# EAGLE design SparkFun Valve Control Shield (EAGLE 9.5.2)
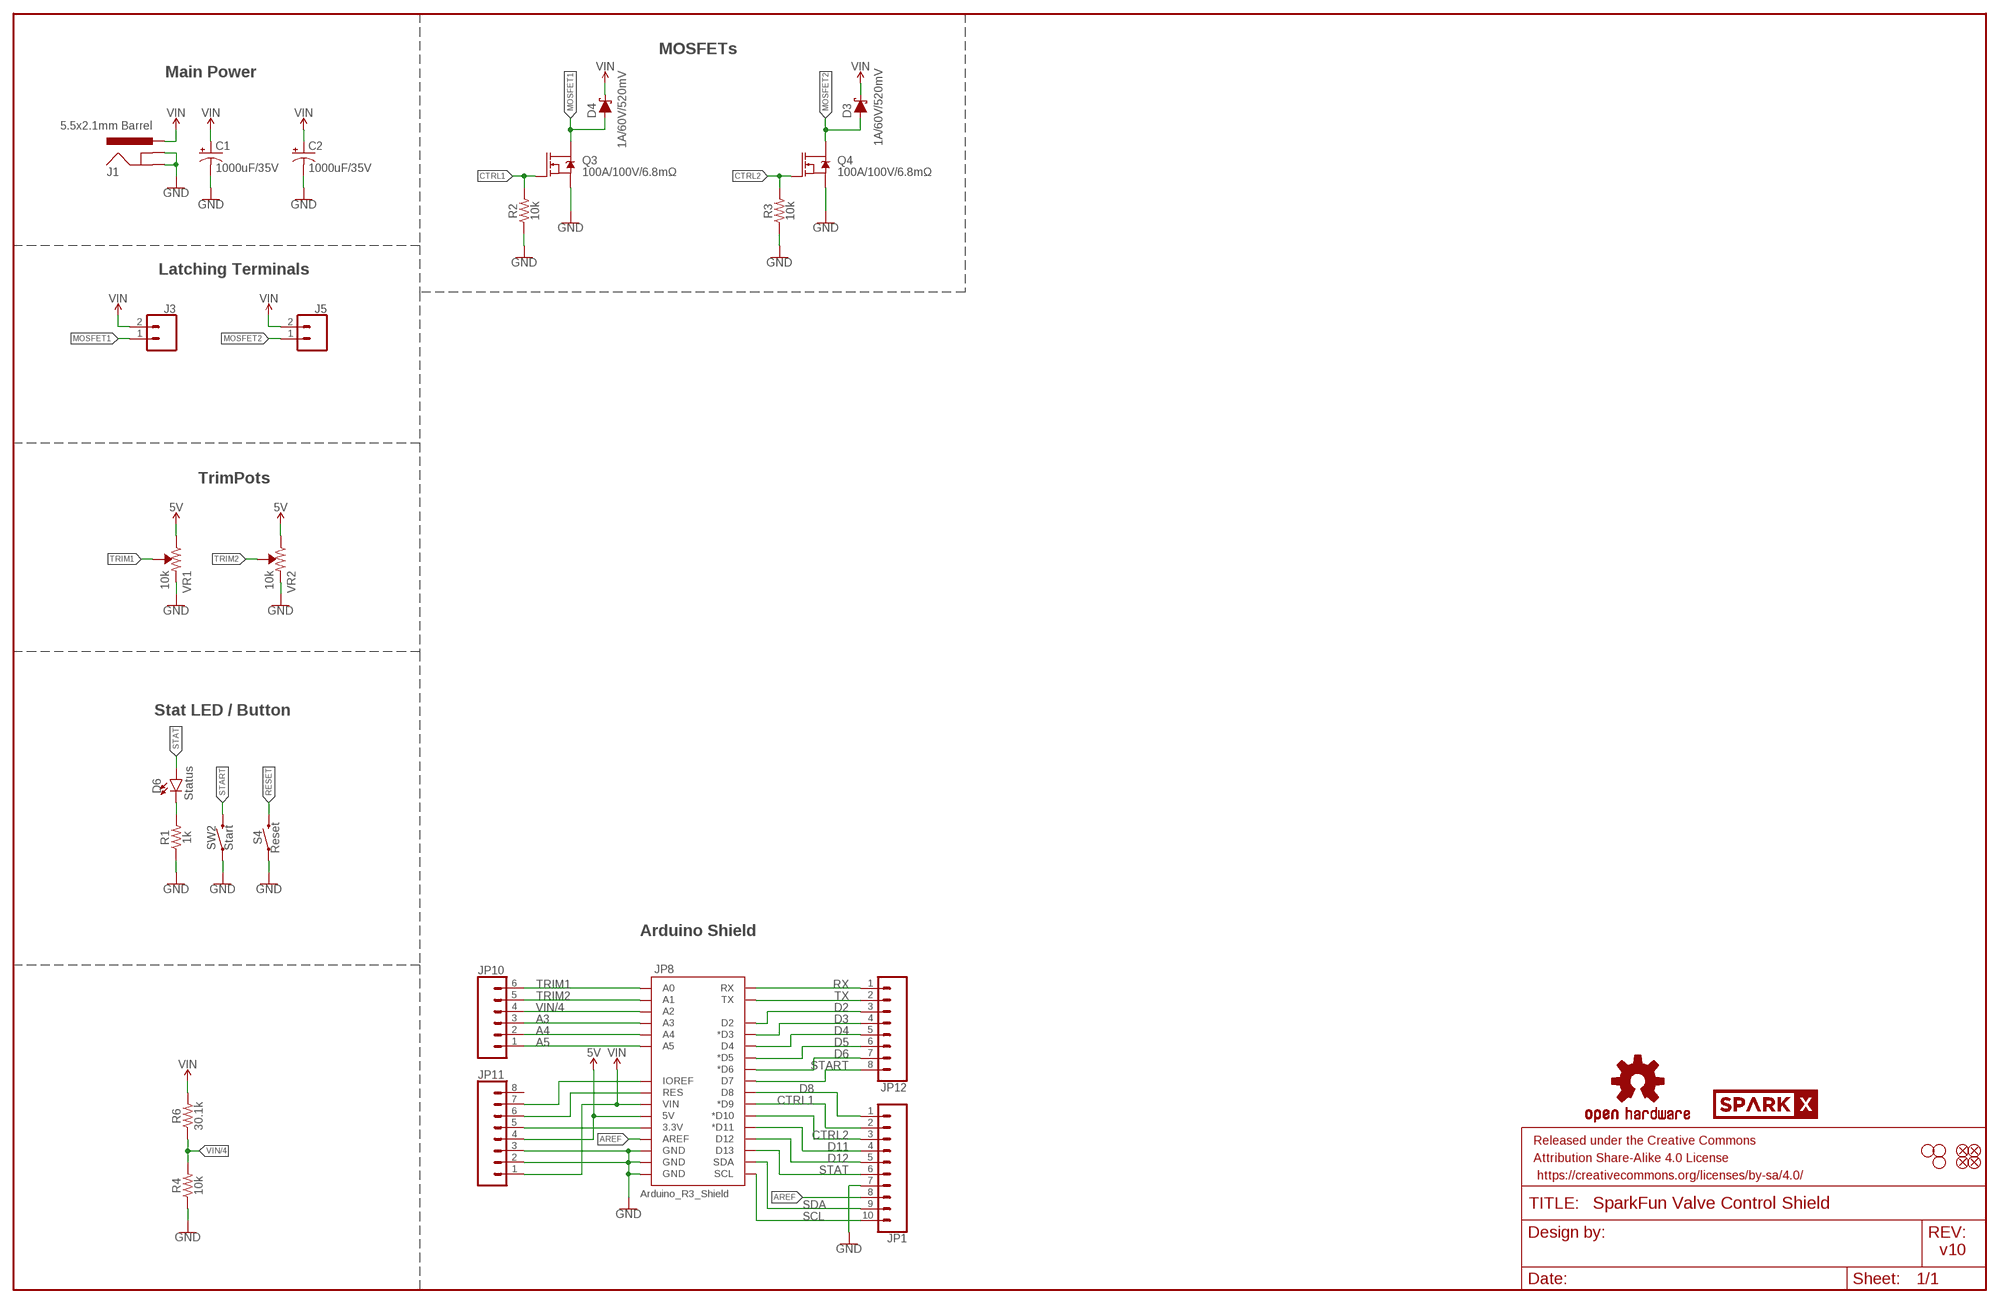
[diagram p0: schematic, sheet 1]

## Parts
C1  1000uF/35V  1000UF-RADIAL-5MM-35V-20%-KIT  [CPOL-RADIAL-5MM-10MM-KIT]
C2  1000uF/35V  1000UF-RADIAL-5MM-35V-20%-KIT  [CPOL-RADIAL-5MM-10MM-KIT]
D3  1A/60V/520mV  DIODE-SCHOTTKY-MSS1P6-M3/89A  [DIODE-MICRO-SMP]
D4  1A/60V/520mV  DIODE-SCHOTTKY-MSS1P6-M3/89A  [DIODE-MICRO-SMP]
D6  Status  LED1206  [LED-1206]
FD1  FIDUCIAL1X2  [FIDUCIAL-1X2]
FD2  FIDUCIAL1X2  [FIDUCIAL-1X2]
FD3  FIDUCIAL1X2  [FIDUCIAL-1X2]
FD4  FIDUCIAL1X2  [FIDUCIAL-1X2]
FRAME2  FRAME-LEDGER  [CREATIVE_COMMONS]
H1  STAND-OFF  [STAND-OFF]
H2  STAND-OFF  [STAND-OFF]
H4  STAND-OFF  [STAND-OFF]
J1  5.5x2.1mm Barrel  POWER_JACKSMD  [POWER_JACK_SMD]
J3  CONN_02LATCH_2  [LATCHTERMINAL-5MM-2]
J5  CONN_02LATCH_2  [LATCHTERMINAL-5MM-2]
JP1  CONN_10NO_SILK_PTH_FEMALE  [1X10_NO_SILK]
JP8  ARDUINO_R3_SHIELDNOLABELS  [UNO_R3_SHIELD_NOLABELS]
JP10  CONN_06NO_SILK_NO_POP  [1X06_NO_SILK]
JP11  CONN_08NO_SILK_FEMALE_PTH  [1X08_NO_SILK]
JP12  CONN_08NO_SILK_FEMALE_PTH  [1X08_NO_SILK]
LOGO1  OSHW-LOGOS  [OSHW-LOGO-S]
Q3  100A/100V/6.8mΩ  MOSFET-NCH-PSMN7R0  [TO-263/D2PAK]
Q4  100A/100V/6.8mΩ  MOSFET-NCH-PSMN7R0  [TO-263/D2PAK]
R1  1k  1KOHM-0603-1/10W-1%  [0603]
R2  10k  10KOHM-0603-1/10W-1%  [0603]
R3  10k  10KOHM-0603-1/10W-1%  [0603]
R4  10k  10KOHM-0603-1/10W-1%  [0603]
R6  30.1k  30.1KOHM-0603-1/10W-1%  [0603]
S4  Reset  MOMENTARY-SWITCH-SPST-SMD-5.2MM-TALL  [TACTILE_SWITCH_SMD_5.2MM]
SW2  Start  MOMENTARY-SWITCH-SPST-SMD-5.2MM-TALL  [TACTILE_SWITCH_SMD_5.2MM]
U$1  SPARKX-LOGO5  [SPARKX-LARGE]
VR1  10k  TRIMPOT-PTH-10MM-KNOB-1/2W-10%  [TRIMPOT-PTH-3386U]
VR2  10k  TRIMPOT-PTH-10MM-KNOB-1/2W-10%  [TRIMPOT-PTH-3386U]

## Nets
3.3: JP8.3.3V JP11.5
5V [power]: JP8.5V JP11.4 VR1.3(CW) VR2.3(CW)
A3: JP8.A3 JP10.3
A4: JP8.A4 JP10.2
A5: JP8.A5 JP10.1
AREF: JP1.8 JP8.AREF
CTRL1: JP1.2 JP8.D9(*D9) Q3.1(G) R2.2
CTRL2: JP1.3 JP8.D10(*D10) Q4.1(G) R3.2
D2: JP8.D2 JP12.3
D3: JP8.D3(*D3) JP12.4
D4: JP8.D4 JP12.5
D5: JP8.D5(*D5) JP12.6
D6: JP8.D6(*D6) JP12.7
D8: JP1.1 JP8.D8
D11: JP1.4 JP8.D11(*D11)
D12: JP1.5 JP8.D12
GND [power]: C1.- C2.- J1.GND(GNDBREAK) J1.P$4(GND) JP1.7 JP8.GND@0(GND) JP8.GND@1(GND) JP8.GND@2(GND) JP11.2 JP11.3 Q3.3(S) Q4.3(S) R1.1 R2.1 R3.1 R4.1 S4.1 SW2.1 VR1.1(CCW) VR2.1(CCW)
MOSFET1: D4.A J3.1 Q3.2(D)
MOSFET2: D3.A J5.1 Q4.2(D)
N$1: JP8.IOREF JP11.7
N$6: D6.C R1.2
RESET: JP8.RES JP11.6 S4.3
RX: JP8.RX JP12.1
SCL: JP1.10 JP8.SCL
SDA: JP1.9 JP8.SDA
START: JP8.D7 JP12.8 SW2.3
STAT: D6.A JP1.6 JP8.D13
TRIM1: JP8.A0 JP10.6 VR1.2(WIPER)
TRIM2: JP8.A1 JP10.5 VR2.2(WIPER)
TX: JP8.TX JP12.2
VIN: C1.+ C2.+ D3.C D4.C J1.VIN0(PWR) J3.2 J5.2 JP8.VIN JP11.1 R6.2
VIN/4: JP8.A2 JP10.4 R4.2 R6.1
Unconnected: JP11.8

## Notes on the sheet
- MOSFETs
- Main Power
- Latching Terminals
- TrimPots
- Stat LED / Button
- Arduino Shield
- Arduino_R3_Shield
- v10

## Library data of the parts
C1 C2 = SparkFun-Capacitors:1000UF: 1,000µF/1mF ceramic capacitors A capacitor is a passive two-terminal electrical component used to store electrical energy temporarily in an electric field. CAP-08070; PROD_ID: CAP-09538; VALUE: 1mf
D3 D4 = SparkFun-DiscreteSemi:DIODE-SCHOTTKY: Schottky diode A Schottky diode is a semiconductor diode which has a low forward voltage drop and a very fast switching action.; PROD_ID: DIO-13919
D6 = SparkFun-LED:LED: LED (Generic) Standard schematic elements and footprints for 5mm, 3mm, 1206, and 0603 sized LEDs. Generic LEDs with no color specified.
FD1-FD4 = SparkFun-Aesthetics:FIDUCIAL: Fiducial Alignment Points Point-of-reference for pick-and-place machines and other optical instruments.
FRAME2 = SparkFun-Aesthetics:FRAME-LEDGER: Schematic Frame - Ledger Standard 11x14 US Ledger frame
H1 H2 H4 = SparkFun-Hardware:STAND-OFF: Stand Off Drill holes for mechanically mounting via screws, standoffs, etc. Note: Use the keepout ring to avoid running the screw head into surrounding components. Variant Overviews STAND-OFF - Mechanical footprint for a #4 phillips button head screw. STAND-OFF-TIGHT - Mechanical footprint for a #4 phillips button head screw, Example SparkFun Products Screw - Phillips Head (1/4", 4-40, 10 pack) <https://www.sparkfun.com/products/10453> (PRT-10453) Screw - Phillips Head (1/2", 4-40, 10 pack) <https://www.sparkfun.com/products/10452> (PRT-10452) Screw - Phillips Head (3/4", 4-40, 10 pack) <https://www.sparkfun.com/products/10451> (PRT-10451) Screw - Phillips Head (1", 4-40, 10 pack) <https://www.sparkfun.com/products/10450> (PRT-10450)
J1 = SparkFun-Connectors:POWER_JACK: Power Jack Connector This is the standard 5.5mm barrel jack for power. The PTH is the most common, proven, reliable, footprint. The Slot footprint only works if the mill layer is transmitted to the PCB fab house so be warned. Here are the connectors we sell at SparkFun: DC Barrel Power Jack/Connector <https://www.sparkfun.com/products/119> (PRT-00119) DC Barrel Power Jack/Connector (SMD) <https://www.sparkfun.com/products/12748> (PRT-12748) DC Barrel Jack Adapter - Breadboard Compatible <https://www.sparkfun.com/products/10811> (PRT-10811) It is used on this SparkFun product (and many, many others): SparkFun RedBoard - Programmed with Arduino <https://www.sparkfun.com/products/12757> (DEV-12757) Also, if you need a mating power supply or connector, please check these out: Wall Adapter Power Supply - 9VDC 650mA <https://www.sparkfun.com/products/298> (TOL-00298) DC Barrel Jack Adapter - Male <https://www.sparkfun.com/products/10287> (PRT-10287); PROD_ID: CONN-08106; SF_ID: PRT-12748
J3 J5 = SparkFun-Connectors:CONN_02: Multi connection point. Often used as Generic Header-pin footprint for 0.1 inch spaced/style header connections On any of the 0.1 inch spaced packages, you can populate with these: Break Away Headers - Straight <https://www.sparkfun.com/products/116> (PRT-00116) Break Away Male Headers - Right Angle <https://www.sparkfun.com/products/553> (PRT-00553) Female Headers <https://www.sparkfun.com/products/115> (PRT-00115) Break Away Headers - Machine Pin <https://www.sparkfun.com/products/117> (PRT-00117) Break Away Female Headers - Swiss Machine Pin <https://www.sparkfun.com/products/743> (PRT-00743) For SCREWTERMINALS and SPRING TERMINALS visit here: Screw Terimnals on SparkFun.com <https://www.sparkfun.com/search/results?term=Screw+Terminals> (5mm/3.5mm/2.54mm spacing) This device is also useful as a general connection point to wire up your design to another part of your project. Our various solder wires solder well into these plated through hole pads. Hook-Up Wire - Assortment (Stranded, 22 AWG) <https://www.sparkfun.com/products/11375> (PRT-11375) Hook-Up Wire - Assortment (Solid Core, 22 AWG) <https://www.sparkfun.com/products/11367> (PRT-11367) View the entire wire category on our website here <https://www.sparkfun.com/categories/141> Special notes: Molex polarized connector foot print use with: PRT-08233 with associated crimp pins and housings. 2.54_SCREWTERM for use with PRT-10571. 3.5mm Screw Terminal footprints for PRT-08084 5mm Screw Terminal footprints for use with PRT-08432; PROD_ID: PRT-15898
JP1 = SparkFun-Connectors:CONN_10: Multi connection point. Often used as Generic Header-pin footprint for 0.1 inch spaced/style header connections On any of the 0.1 inch spaced packages, you can populate with these: Break Away Headers - Straight <https://www.sparkfun.com/products/116> (PRT-00116) Break Away Male Headers - Right Angle <https://www.sparkfun.com/products/553> (PRT-00553) Female Headers <https://www.sparkfun.com/products/115> (PRT-00115) Break Away Headers - Machine Pin <https://www.sparkfun.com/products/117> (PRT-00117) Break Away Female Headers - Swiss Machine Pin <https://www.sparkfun.com/products/743> (PRT-00743) Arduino Stackable Header - 10 Pin <https://www.sparkfun.com/products/11376> (PRT-11376) For SCREWTERMINALS and SPRING TERMINALS visit here: Screw Terimnals on SparkFun.com <https://www.sparkfun.com/search/results?term=Screw+Terminals> (5mm/3.5mm/2.54mm spacing) This device is also useful as a general connection point to wire up your design to another part of your project. Our various solder wires solder well into these plated through hole pads. Hook-Up Wire - Assortment (Stranded, 22 AWG) <https://www.sparkfun.com/products/11375> (PRT-11375) Hook-Up Wire - Assortment (Solid Core, 22 AWG) <https://www.sparkfun.com/products/11367> (PRT-11367) View the entire wire category on our website here <https://www.sparkfun.com/categories/141> Special notes: Molex polarized connector foot print use with SKU : PRT-08231 with associated crimp pins and housings. 1MM SMD Version SKU: PRT-10208 NOTES ON THE VARIANTS LOCK and LOCK_LONGPADS... This footprint was designed to help hold the alignment of a through-hole component (i.e. 6-pin header) while soldering it into place. You may notice that each hole has been shifted either up or down by 0.005 of an inch from it's more standard position (which is a perfectly straight line). This slight alteration caused the pins (the squares in the middle) to touch the edges of the holes. Because they are alternating, it causes a "brace" to hold the component in place. 0.005 has proven to be the perfect amount of "off-center" position when using our standard breakaway headers. Although looks a little odd when you look at the bare footprint, once you have a header in there, the alteration is very hard to notice. Also,if you push a header all the way into place, it is covered up entirely on the bottom side.
JP8 = TempLibrary:ARDUINO_R3_SHIELD: Shield form compatible with the Arduino Uno R3.
JP10 = SparkFun-Connectors:CONN_06: Multi connection point. Often used as Generic Header-pin footprint for 0.1 inch spaced/style header connections On any of the 0.1 inch spaced packages, you can populate with these: Break Away Headers - Straight <https://www.sparkfun.com/products/116> (PRT-00116) Break Away Male Headers - Right Angle <https://www.sparkfun.com/products/553> (PRT-00553) Female Headers <https://www.sparkfun.com/products/115> (PRT-00115) Break Away Headers - Machine Pin <https://www.sparkfun.com/products/117> (PRT-00117) Break Away Female Headers - Swiss Machine Pin <https://www.sparkfun.com/products/743> (PRT-00743) Arduino Stackable Header - 6 Pin <https://www.sparkfun.com/products/9280> (PRT-09280) For SCREWTERMINALS and SPRING TERMINALS visit here: Screw Terimnals on SparkFun.com <https://www.sparkfun.com/search/results?term=Screw+Terminals> (5mm/3.5mm/2.54mm spacing) This device is also useful as a general connection point to wire up your design to another part of your project. Our various solder wires solder well into these plated through hole pads. Hook-Up Wire - Assortment (Stranded, 22 AWG) <https://www.sparkfun.com/products/11375> (PRT-11375) Hook-Up Wire - Assortment (Solid Core, 22 AWG) <https://www.sparkfun.com/products/11367> (PRT-11367) View the entire wire category on our website here <https://www.sparkfun.com/categories/141>
JP11 JP12 = SparkFun-Connectors:CONN_08: Multi connection point. Often used as Generic Header-pin footprint for 0.1 inch spaced/style header connections On any of the 0.1 inch spaced packages, you can populate with these: Break Away Headers - Straight <https://www.sparkfun.com/products/116> (PRT-00116) Break Away Male Headers - Right Angle <https://www.sparkfun.com/products/553> (PRT-00553) Female Headers <https://www.sparkfun.com/products/115> (PRT-00115) Break Away Headers - Machine Pin <https://www.sparkfun.com/products/117> (PRT-00117) Break Away Female Headers - Swiss Machine Pin <https://www.sparkfun.com/products/743> (PRT-00743) Arduino Stackable Header - 8 Pin <https://www.sparkfun.com/products/9279> (PRT-09279) For SCREWTERMINALS and SPRING TERMINALS visit here: Screw Terimnals on SparkFun.com <https://www.sparkfun.com/search/results?term=Screw+Terminals> (5mm/3.5mm/2.54mm spacing) This device is also useful as a general connection point to wire up your design to another part of your project. Our various solder wires solder well into these plated through hole pads. Hook-Up Wire - Assortment (Stranded, 22 AWG) <https://www.sparkfun.com/products/11375> (PRT-11375) Hook-Up Wire - Assortment (Solid Core, 22 AWG) <https://www.sparkfun.com/products/11367> (PRT-11367) View the entire wire category on our website here <https://www.sparkfun.com/categories/141> Special notes: Molex polarized connector foot print use with SKU : PRT-08231 with associated crimp pins and housings. 1MM SMD Version SKU: PRT-10208 NOTES ON THE VARIANTS LOCK and LOCK_LONGPADS... This footprint was designed to help hold the alignment of a through-hole component (i.e. 6-pin header) while soldering it into place. You may notice that each hole has been shifted either up or down by 0.005 of an inch from it's more standard position (which is a perfectly straight line). This slight alteration caused the pins (the squares in the middle) to touch the edges of the holes. Because they are alternating, it causes a "brace" to hold the component in place. 0.005 has proven to be the perfect amount of "off-center" position when using our standard breakaway headers. Although looks a little odd when you look at the bare footprint, once you have a header in there, the alteration is very hard to notice. Also,if you push a header all the way into place, it is covered up entirely on the bottom side.; PROD_ID: CONN-08438
LOGO1 = SparkFun-Aesthetics:OSHW-LOGO: Open-Source Hardware (OSHW) Logo This logo indicates the piece of hardware it is found on incorporates a OSHW license and/or adheres to the definition of open source hardware found here: http://freedomdefined.org/OSHW
Q3 Q4 = SparkFun-DiscreteSemi:MOSFET-NCH: N-channel MOSFETs Voltage controlled devices that allow control of high current outputs. SparkFun Products: SparkFun OpenScale <https://www.sparkfun.com/products/13261> SparkFun Digital Sandbox <https://www.sparkfun.com/products/12651> SparkFun Monster Moto Shield <https://www.sparkfun.com/products/10182> SparkFun MOSFET Power Controller <https://www.sparkfun.com/products/11214>; PROD_ID: TRANS-12437
R1 = SparkFun-Resistors:1KOHM: 1kΩ resistor A resistor is a passive two-terminal electrical component that implements electrical resistance as a circuit element. Resistors act to reduce current flow, and, at the same time, act to lower voltage levels within circuits. - Wikipedia; PROD_ID: RES-07856
R2-R4 = SparkFun-Resistors:10KOHM: 10kΩ resistor A resistor is a passive two-terminal electrical component that implements electrical resistance as a circuit element. Resistors act to reduce current flow, and, at the same time, act to lower voltage levels within circuits. - Wikipedia; PROD_ID: RES-00824
R6 = SparkFun-Resistors:30.1KOHM: 30.1kΩ resistor A resistor is a passive two-terminal electrical component that implements electrical resistance as a circuit element. Resistors act to reduce current flow, and, at the same time, act to lower voltage levels within circuits. - Wikipedia; PROD_ID: RES-14417
S4 SW2 = SparkFun-Switches:MOMENTARY-SWITCH-SPST: Momentary Switch (Pushbutton) - SPST Normally-open (NO) SPST momentary switches (buttons, pushbuttons). Variants PTH-12MM - 12mm square, through-hole Momentary Pushbutton Switch - 12mm Square <https://www.sparkfun.com/products/9190> (COM-09190) PTH-6.0MM, PTH-6.0MM-KIT - 6.0mm square, through-hole Mini Pushbutton Switch <https://www.sparkfun.com/products/97> (COM-00097) KIT package intended for soldering kit's - only one side of pads' copper is exposed. PTH-RIGHT-ANGLE-KIT - Right-angle, through-hole Right Angle Tactile Button <https://www.sparkfun.com/products/10791> - Used on SparkFun BigTime Watch Kit <https://www.sparkfun.com/products/11734> SMD-12MM - 12mm square, surface-mount Tactile Button - SMD (12mm) <https://www.sparkfun.com/products/12993> (COM-12993) Used on SparkFun PicoBoard <https://www.sparkfun.com/products/11888> SMD-4.5MM - 4.5mm Square Trackball Switch Used on SparkFun Blackberry Trackballer Breakout <https://www.sparkfun.com/products/13169> SMD-4.6MMX2.8MM - 4.60mm x 2.80mm, surface mount Used on SparkFun SAMD21 Mini Breakout <https://www.sparkfun.com/products/13664> SMD-5.2MM, SMD-5.2-REDUNDANT - 5.2mm square, surface-mount Mini Pushbutton Switch - SMD <https://www.sparkfun.com/products/8720> (COM-08720) Used on Arduino Pro Mini <https://www.sparkfun.com/products/11114> REDUNDANT package connects both switch circuits together SMD-6.0X3.5MM - 6.0 x 3.5mm, surface mount Momentary Reset Switch SMD <https://www.sparkfun.com/products/8229> (COM-08229) SMD-6.2MM-TALL - 6.2mm square, surface mount Tactile Button - SMD (6mm) <https://www.sparkfun.com/products/12992> Used on SparkFun Digital Sandbox <https://www.sparkfun.com/products/12651> SMD-RIGHT-ANGLE - Right-angle, surface mount Used on SparkFun Block for Intel® Edison - Arduino <https://www.sparkfun.com/products/13036>; PROD_ID: SWCH-14139
U$1 = SparkX:SPARKX-LOGO
VR1 VR2 = SparkFun-Resistors:TRIMPOT: Trimming Potentiometer (Trimpot) Three-terminal potentiometers, with an adjustable wiper and two adjustable resistors. A pot can be used to create a configurable voltage divider, or as a variable resistor. "Trimpots" are a subset of potentiometers, usually intended for "set-and-forget" applications. They're often more delicate than standard potentiometers - rated for fewer turns. Variants PTH-KNOB - PTH Trimpot w/ finger-adjustable knob Trimpot 10K with Knob <https://www.sparkfun.com/products/9806> (COM-09806) Datasheet <http://www.sparkfun.com/datasheets/Components/General/TSR-3386.pdf> SMD-3MM-CLOSED-FRAME - SMD 3mm Square Closed-Frame Trimpot Used on e.g. EasyDriver - Stepper Motor Driver <https://www.sparkfun.com/products/12779> Datasheet <http://www.bitechnologies.com/pdfs/22.pdf> (22AR10KTR) SMD-5MM - SMD 5mm Square Closed-Frame Trimpot Used on e.g. IOIO-OTG - V2.2 <https://www.sparkfun.com/products/13613> Datasheet <http://www.vishay.com/docs/51008/ts53.pdf> (TS53YL502MR10) SMD-3MM-1/10W-25% - 3mm Square Open-Frame Trimpot Used on e.g. SparkFun Shapeoko <https://www.sparkfun.com/products/13899> Datasheet <http://www.bourns.com/docs/Product-Datasheets/TC33.pdf> (TC33X-2-103E); PROD_ID: RES-09730; SF_SKU: COM-09806

## Net classes
1 power: width 0.254 mm

## Board
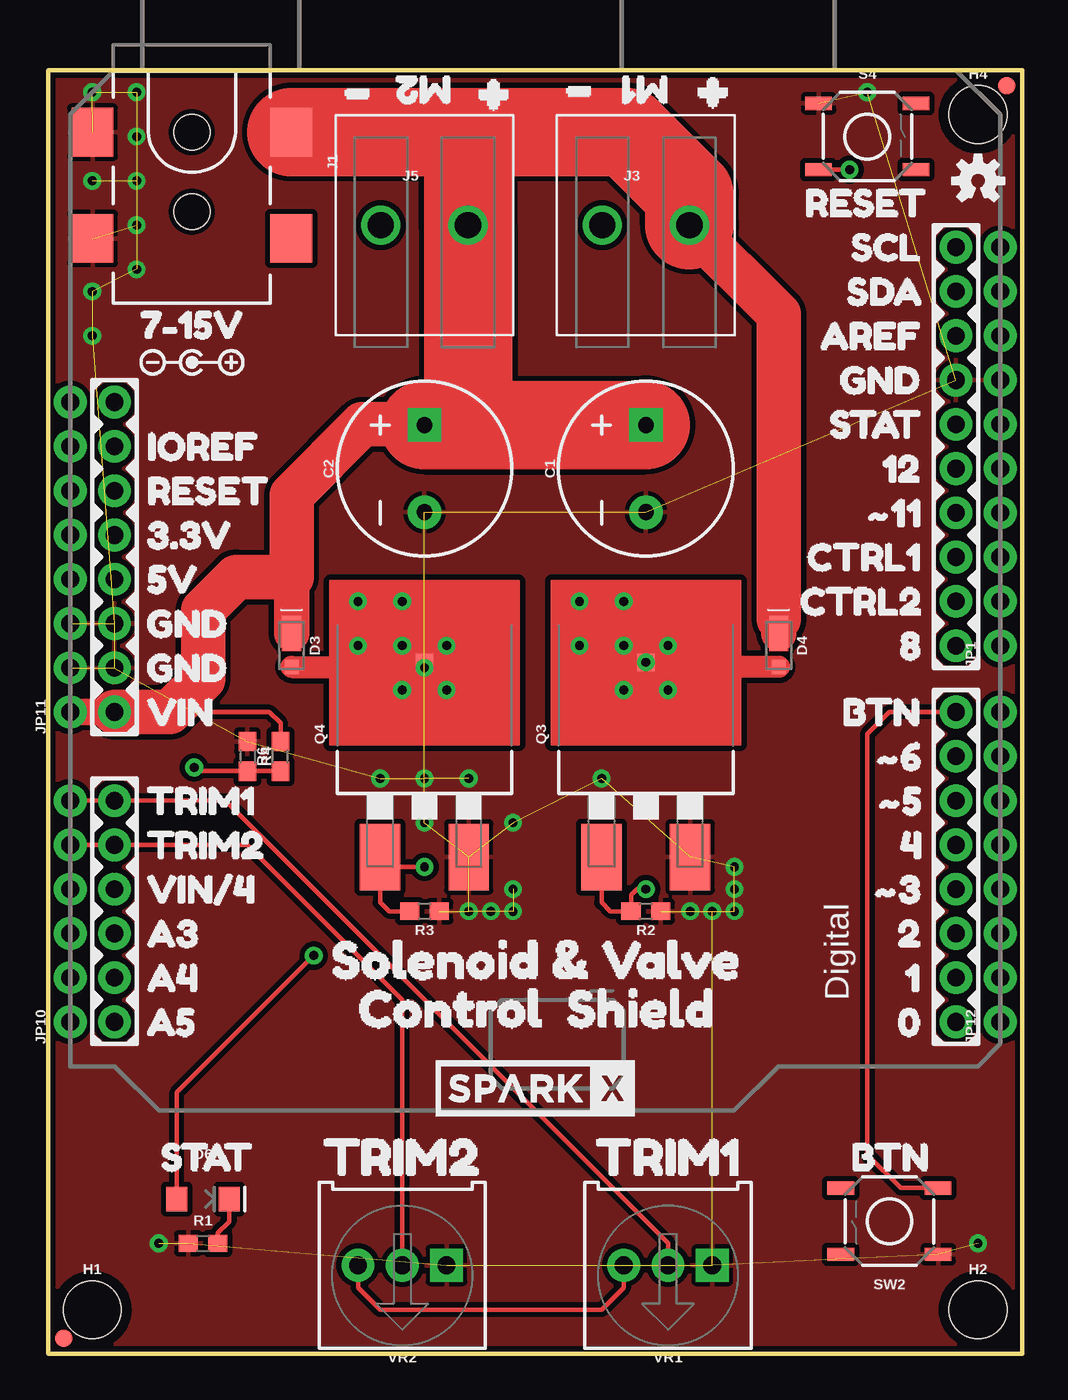
[diagram p1: board, top side]
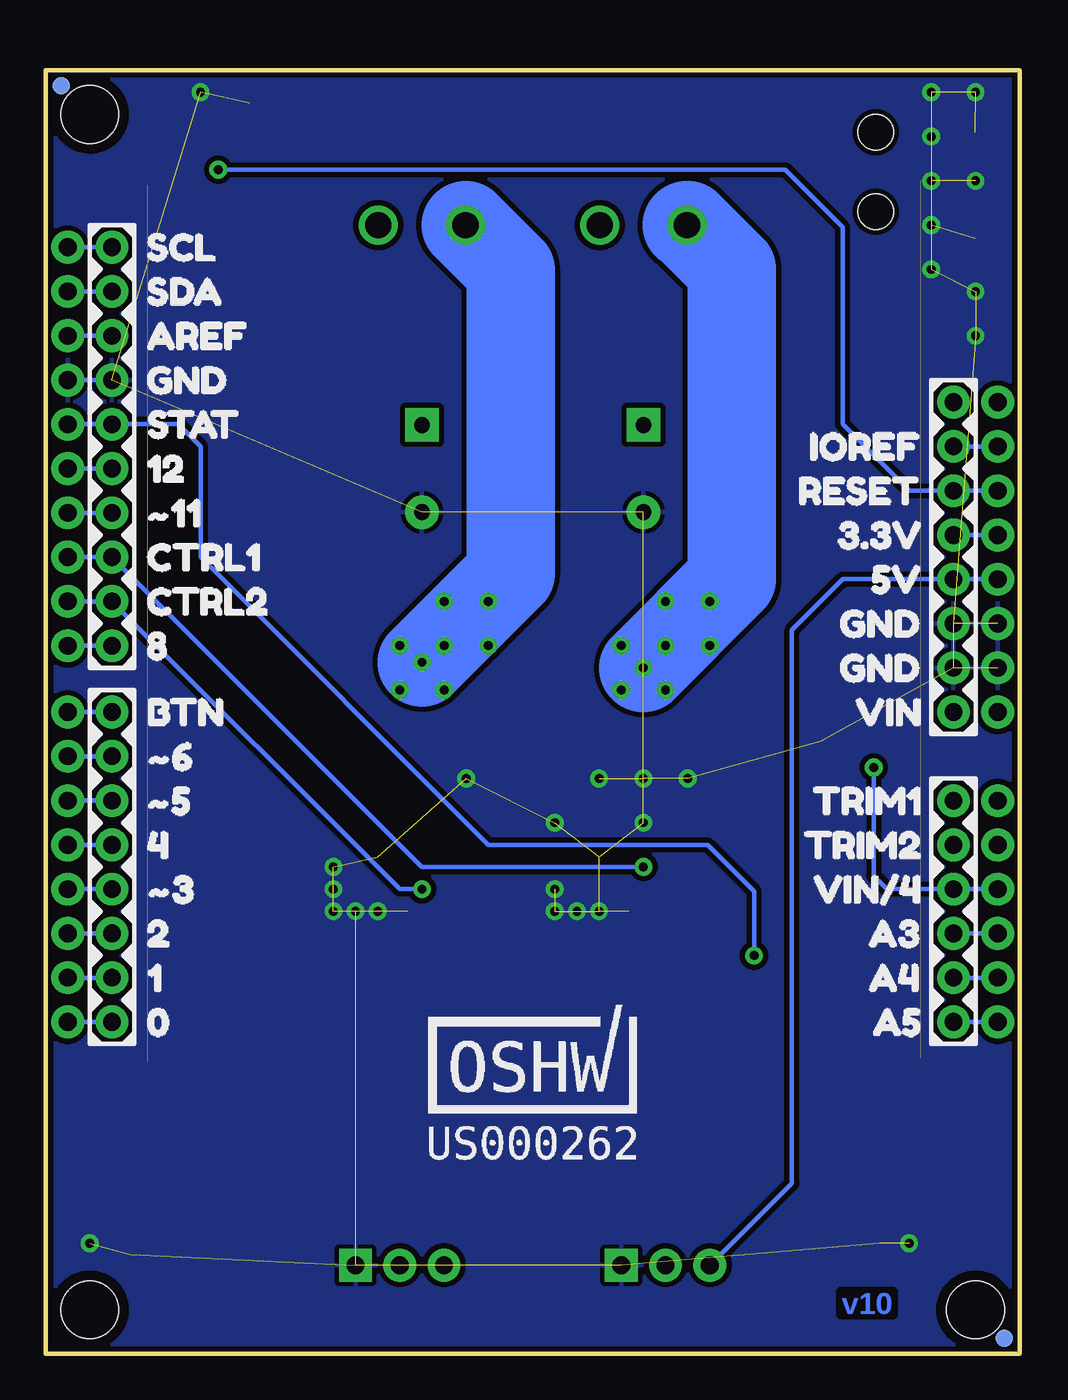
[diagram p2: board, bottom side, seen from below]

Size 55.88 x 73.66 mm. Coordinates in mm from the lower left corner, seen from the top.
Outline: 0,0 0,73.66 55.88,73.66 55.88,0 0,0
Copper layers (1*16): Top 0.035mm / dielectric 1.5mm / Bottom 0.035mm
Design rules "SparkFun-2-layer-STANDARD *": minimum track width 10mil, minimum drill 20mil, track to track 12mil, track to pad 12mil, pad to pad 12mil, via to via 12mil, smd to smd 12mil, copper to edge 8mil, drill to drill 8mil, minimum pad ring 10mil, minimum via ring 10mil, stop-mask expansion 4mil, vias tented up to drill 25mil, thermal gap 10mil

### Footprints (pad centres in the part's own frame; a part is rotated, then mirrored left to right if it is on the bottom)
CPOL-RADIAL-5MM-10MM-KIT = drill 0.9 pad 1.93 square: + 2.5,0 | drill 0.9 pad 1.93: - -2.5,0
DIODE-MICRO-SMP = smd 0.813 x 0.813: A 1.219,0 | smd 2.007 x 1.102: C -0.699,0
LED-1206 = smd 1.2 x 1.4: A -1.5,0; C 1.5,0
FIDUCIAL-1X2 = smd 1 x 1: 1 0,0
STAND-OFF = hole 3.302: 0,0
POWER_JACK_SMD = smd 2.8 x 2.4: GND 0,-5.7; P$4 6.1,-5.7; VIN0 0,5.7; VIN1 6.1,5.7 | hole 2.032: 0,0; 4.572,0
LATCHTERMINAL-5MM-2 = drill 1.5: 1 -2.5,0; 2 2.5,0
1X10_NO_SILK = drill 1.016 pad 1.88: 1 0,0; 2 2.54,0; 3 5.08,0; 4 7.62,0; 5 10.16,0; 6 12.7,0; 7 15.24,0; 8 17.78,0; 9 20.32,0; 10 22.86,0
UNO_R3_SHIELD_NOLABELS = drill 1.016 pad 1.88: 3.3V 50.8,26.67; 5V 50.8,29.21; A0 50.8,41.91; A1 50.8,44.45; A2 50.8,46.99; A3 50.8,49.53; A4 50.8,52.07; A5 50.8,54.61; AREF 2.54,15.24; D2 2.54,49.53; D3 2.54,46.99; D4 2.54,44.45; D5 2.54,41.91; D6 2.54,39.37; D7 2.54,36.83; D8 2.54,33.02; D9 2.54,30.48; D10 2.54,27.94; D11 2.54,25.4; D12 2.54,22.86; D13 2.54,20.32; GND@0 50.8,31.75; GND@1 50.8,34.29; GND@2 2.54,17.78; IOREF 50.8,21.59; NC 50.8,19.05; RES 50.8,24.13; RX 2.54,54.61; SCL 2.54,10.16; SDA 2.54,12.7; TX 2.54,52.07; VIN 50.8,36.83
1X06_NO_SILK = drill 1.016 pad 1.88: 1 0,0; 2 2.54,0; 3 5.08,0; 4 7.62,0; 5 10.16,0; 6 12.7,0
1X08_NO_SILK = drill 1.016 pad 1.88: 1 0,0; 2 2.54,0; 3 5.08,0; 4 7.62,0; 5 10.16,0; 6 12.7,0; 7 15.24,0; 8 17.78,0
TO-263/D2PAK = smd 2.32 x 3.81: 1 -2.54,-7.045; 3 2.54,-7.045 | smd 1 x 1: 2 0,4.125
0603 = smd 1.1 x 1: 1 -0.85,0; 2 0.85,0
TACTILE_SWITCH_SMD_5.2MM = smd 1.524 x 0.762: 1 -2.794,1.905; 2 2.794,1.905; 3 -2.794,-1.905; 4 2.794,-1.905
TRIMPOT-PTH-3386U = drill 1.016 pad 1.88 square: 1 -2.54,-0.015 | drill 1.016 pad 1.88: 2 0,-0.015; 3 2.54,-0.015

### Placement (x,y rotation side)
C1  34.29,50.8 90 top
C2  21.59,50.8 90 top
D3  13.97,40.64 270 top
D4  41.91,40.64 270 top
D6  8.89,8.89 0 top
FD1  54.99,72.77 0 top
FD2  54.99,72.77 0 bottom
FD3  0.89,0.89 0 bottom
FD4  0.89,0.89 0 top
FRAME2  15.24,-27.94 0 top  (outside the outline)
H1  2.54,2.54 0 top
H2  53.34,2.54 0 top
H4  53.34,71.12 0 top
J1  8.26,70.1 270 top
J3  34.29,64.77 0 top
J5  21.59,64.77 0 top
JP1  54.61,40.64 90 top
JP8  54.61,73.66 180 top
JP10  1.27,19.05 90 top
JP11  1.27,36.83 90 top
JP12  54.61,19.05 90 top
LOGO1  53.34,67.31 0 top
Q3  34.29,35.56 0 top
Q4  21.59,35.56 0 top
R1  8.89,6.35 0 top
R2  34.29,25.4 180 top
R3  21.59,25.4 180 top
R4  11.43,34.29 270 top
R6  13.34,34.29 90 top
S4  46.99,69.85 0 top
SW2  48.26,7.62 180 top
U$1  27.94,15.24 0 top
U$2  [RESET1]  42.04,66.04 0 top
U$3  [3#3V8]  11.81,46.99 0 bottom
U$4  [POLARITY_MARKING_CENTER_POSITIVE#JPG]  8.26,56.9 0 top
U$5  [#58]  46.23,31.75 0 top
U$6  [#67]  46.1,34.29 0 top
U$7  [VIN0]  4.32,36.83 0 top
U$8  [7#15V0]  3.94,59.05 0 top
U$9  [#115]  45.59,48.26 0 top
U$10  [#314]  45.97,26.67 0 top
U$11  [49]  47.5,29.21 0 top
U$12  [86]  47.5,40.64 0 top
U$13  [116]  47.5,21.59 0 top
U$14  [017]  47.37,19.05 0 top
U$15  [124]  46.48,50.8 0 top
U$16  [215]  47.37,24.13 0 top
U$17  [AREF11]  42.93,58.42 0 top
U$18  [CTRL12]  41.91,45.72 0 top
U$19  [CTRL23]  41.78,43.18 0 top
U$20  [GND10]  44.07,55.88 0 top
U$21  [SCL13]  44.7,63.5 0 top
U$22  [SDA12]  44.45,60.96 0 top
U$23  [STAT1]  43.43,53.34 0 top
U$24  [3#3V8]  4.32,46.99 0 top
U$25  [5V7]  4.32,44.45 0 top
U$26  [5V7]  9.91,44.45 0 bottom
U$27  [VIN#40]  13.21,26.67 0 bottom
U$28  [A32]  4.06,24.13 0 top
U$29  [A43]  4.06,21.59 0 top
U$30  [A54]  4.32,19.05 0 top
U$31  [GND6]  4.32,41.91 0 top
U$32  [GND6]  4.32,39.37 0 top
U$33  [IOREF10]  4.32,52.07 0 top
U$34  [RESET9]  4.32,49.53 0 top
U$35  [STAT1]  5.08,11.3 0 top
U$36  [BTN1]  44.2,36.83 0 top
U$37  [BTN1]  44.7,11.3 0 top
U$38  [CONTROL2]  16,19.81 0 top
U$39  [SHIELD0]  27.94,19.81 0 top
U$40  [TRIM10]  29.59,11.3 0 top
U$41  [SOLENOID_#_VALVE5]  14.48,22.61 0 top
U$42  [TRIM12]  4.06,31.75 0 top
U$43  [TRIM21]  13.97,11.3 0 top
U$44  [TRIM23]  4.06,29.21 0 top
U$45  [#2]  41.27,72.01 180 top
U$46  [#3]  33.53,71.88 180 top
U$47  [#2]  28.7,71.88 180 top
U$48  [#3]  20.83,71.75 180 top
U$49  [GND6]  11.68,41.91 0 bottom
U$50  [M11]  36.96,72.52 180 top
U$51  [M22]  24.51,72.52 180 top
U$52  [GND6]  11.68,39.37 0 bottom
U$53  [IOREF10]  13.46,52.07 0 bottom
U$54  [RESET9]  14.1,49.53 0 bottom
U$55  [VIN0]  10.79,36.83 0 bottom
U$56  [OSHW_MARK_US000262#PNG]  27.94,15.24 0 bottom
U$57  [A32]  10.29,24.13 0 bottom
U$58  [A43]  10.29,21.59 0 bottom
U$59  [A54]  9.78,19.05 0 bottom
U$60  [TRIM12]  13.46,31.75 0 bottom
U$61  [TRIM23]  13.97,29.21 0 bottom
U$62  [#115]  51.44,48.26 0 bottom
U$63  [124]  51.44,50.8 0 bottom
U$64  [AREF11]  51.44,58.42 0 bottom
U$65  [CTRL12]  51.69,45.72 0 bottom
U$66  [CTRL23]  51.44,43.18 0 bottom
U$67  [GND10]  51.44,55.88 0 bottom
U$68  [SCL13]  51.44,63.5 0 bottom
U$69  [SDA12]  51.44,60.96 0 bottom
U$70  [STAT1]  51.44,53.34 0 bottom
U$71  [86]  51.44,40.64 0 bottom
U$72  [#58]  51.44,31.75 0 bottom
U$73  [#67]  51.44,34.29 0 bottom
U$74  [#314]  51.44,26.67 0 bottom
U$75  [49]  51.44,29.21 0 bottom
U$76  [116]  51.69,21.59 0 bottom
U$77  [017]  51.44,19.05 0 bottom
U$78  [215]  51.44,24.13 0 bottom
U$79  [BTN1]  51.44,36.83 0 bottom
U$80  [VIN#40]  4.32,26.67 0 top
VR1  35.56,5.08 180 top
VR2  20.32,5.08 180 top

### Tracks (layer width: path | path; a pad name or v marks a point on that pad's centre or on a via)
3.3
  Bottom 0.254: JP8.3.3V JP11.5
5V
  Top 0.254: VR1.3 33.02,3.81 31.75,2.54 19.05,2.54 17.78,3.81 VR2.3
  Bottom 0.254: JP11.4 JP8.5V 10.16,44.45 13.08,41.53 13.08,9.79 VR2.3
A3
  Bottom 0.254: JP10.3 JP8.A3
A4
  Bottom 0.254: JP8.A4 JP10.2
A5
  Bottom 0.254: JP10.1 JP8.A5
AREF
  Bottom 0.254: JP1.8 JP8.AREF
CTRL1  (via drill 0.51)
  Top 0.254: Q3.1 31.75,25.91 32.26,25.4 R2.2 33.44,26.33 33.78,26.67 v34.29,26.67
  Bottom 0.254: v34.29,26.67 35.56,26.67 JP8.D9 JP1.2
CTRL2  (via drill 0.51)
  Top 0.254: R3.2 19.56,25.4 19.05,25.91 Q4.1 19.62,27.94 v21.59,27.94
  Bottom 0.254: v21.59,27.94 34.29,27.94 JP8.D10 JP1.3
D2
  Bottom 0.254: JP8.D2 JP12.3
D3
  Bottom 0.254: JP12.4 JP8.D3
D4
  Bottom 0.254: JP8.D4 JP12.5
D5
  Bottom 0.254: JP12.6 JP8.D5
D6
  Bottom 0.254: JP12.7 JP8.D6
D8
  Bottom 0.254: JP1.1 JP8.D8
D11
  Bottom 0.254: JP1.4 JP8.D11
D12
  Bottom 0.254: JP1.5 JP8.D12
GND  (via drill 0.51)  (45 unrouted)
  Bottom 0.254: JP1.7 JP8.GND@2
  other vias: 24.13,25.4 26.67,25.4 26.67,26.67 36.83,25.4 39.37,25.4 39.37,26.67 39.37,27.94 26.67,30.48 21.59,30.48 24.13,33.02 31.75,33.02 19.05,33.02 21.59,33.02 38.1,25.4 25.4,25.4 2.54,60.96 5.08,62.23 5.08,64.77 5.08,67.31 5.08,69.85 5.08,72.39 2.54,72.39 2.54,67.31 2.54,58.42 6.35,6.35 53.34,6.35 46.99,72.39
  pour Top (isolate 0.305): 55.88,0 0,0 0,73.66 55.88,73.66
  pour Bottom (isolate 0.305): 55.88,0 0,0 0,73.66 55.88,73.66
MOSFET1  (via drill 0.51)
  Top 0.254: v30.48,40.64 v30.48,43.18 v33.02,43.18 v33.02,40.64 34.24,39.42 34.34,39.42 | 34.34,39.42 34.55,39.42 | v35.56,40.64 34.34,39.42 | v35.56,38.1 35.56,38.41 Q3.2 34.29,39.37 v33.02,38.1
  Top 1.27: D4.A 34.55,39.42 Q3.2
  Bottom 5.08: J3.1 29.21,62.19 29.21,44.77 Q3.2
  other vias: 34.29,39.69
MOSFET2  (via drill 0.51)
  Top 0.254: 21.54,39.42 v21.59,39.37 v22.86,38.1 | v17.78,40.64 v20.32,40.64 | v20.32,40.64 21.54,39.42 | Q4.2 21.59,39.47 | 21.59,39.47 21.54,39.42 | v20.32,38.1 20.32,38.2 21.54,39.42 | v22.86,40.64 22.76,40.64 21.59,39.47 | v20.32,40.64 v20.32,43.18 v17.78,43.18
  Top 1.27: D3.A 21.54,39.42
  Bottom 0.254: 16.51,44.77 16.51,44.45
  Bottom 5.08: J5.1 19.05,64.77 16.51,62.23 16.51,44.77 | 16.51,44.45 v21.59,39.37
N$1
  Bottom 0.254: JP8.IOREF JP11.7
N$6
  Top 0.254: D6.C 10.39,7.6 9.74,6.95 R1.2
RESET  (via drill 0.51)
  Top 0.254: S4.3 v45.97,67.94
  Bottom 0.254: JP11.6 JP8.RES 6.35,49.53 10.16,53.34 10.16,64.64 13.46,67.94 v45.97,67.94
RX
  Bottom 0.254: JP8.RX JP12.1
SCL
  Bottom 0.254: JP1.10 JP8.SCL
SDA
  Bottom 0.254: JP1.9 JP8.SDA
START
  Top 0.254: JP8.D7 48.26,36.83 46.99,35.56 46.99,11.43 48.9,9.53 SW2.3
  Bottom 0.254: JP12.8 JP8.D7
STAT  (via drill 0.51)
  Top 0.254: D6.A 7.39,15.01 v15.24,22.86
  Bottom 0.254: v15.24,22.86 15.24,26.54 17.91,29.21 30.48,29.21 46.99,45.72 46.99,52.07 48.26,53.34 JP8.D13 JP1.6
TRIM1
  Top 0.254: JP10.6 JP8.A0 10.16,31.75 35.56,6.35 VR1.2
TRIM2
  Top 0.254: VR2.2 20.32,20.32 11.43,29.21 JP8.A1 JP10.5
TX
  Bottom 0.254: JP12.2 JP8.TX
VIN
  Top 0.254: R6.2 13.34,36.2 12.7,36.83 6.99,36.83
  Top 1.524: JP8.VIN JP11.1
  Top 2.032: D3.C 13.97,44.58 | D4.C 41.91,42.16
  Top 2.54: 24.09,70.06 24.13,70.1 | J3.2 41.91,59.65 41.91,42.16 | C2.+ 21.55,53.34 18.03,53.34 13.97,49.28 13.97,44.58 10.79,44.58 8.89,42.67 8.89,38.73 6.99,36.83 JP8.VIN | 24.09,53.39 24,53.3
  Top 5.08: J3.2 36.79,66.55 33.23,70.1 24.13,70.1 J1.VIN0 | 24.09,70.06 J5.2 24.09,53.39 | C2.+ 24,53.3 C1.+
VIN/4  (via drill 0.51)
  Top 0.254: R6.1 R4.2 8.6,33.44 v8.38,33.66
  Bottom 0.254: JP10.4 JP8.A2 7.62,26.67 8.38,27.43 v8.38,33.66

### Text on the board
Bottom: v10
tNames: Digital